# Altium project Phaser.PrjPCB (part 3 of 5)

## Sheet DAC.SchDoc: Phaser
size 420 x 297 mm; EDA_Number: ARTIQ; Projet: ARTIQ/SINARA; Author: G.Kasprowicz; CompanyName: WUT ISE; DrawnBy: G.Kasprowicz; Organization: WUT ISE; Address1: PW ISE; Address2: Nowowiejska 15/19 00-665 Warsaw; Address3: gkasprow@gmail.com; Revision: 2; SheetNumber: -; SheetTotal: -; ModifiedBy: -; CheckedDate: -; Title2: xxx; DivGrp: WUT ISE; Designer: G.Kasprowicz; ModifiedDate: -; ProjectName: Sensor Box
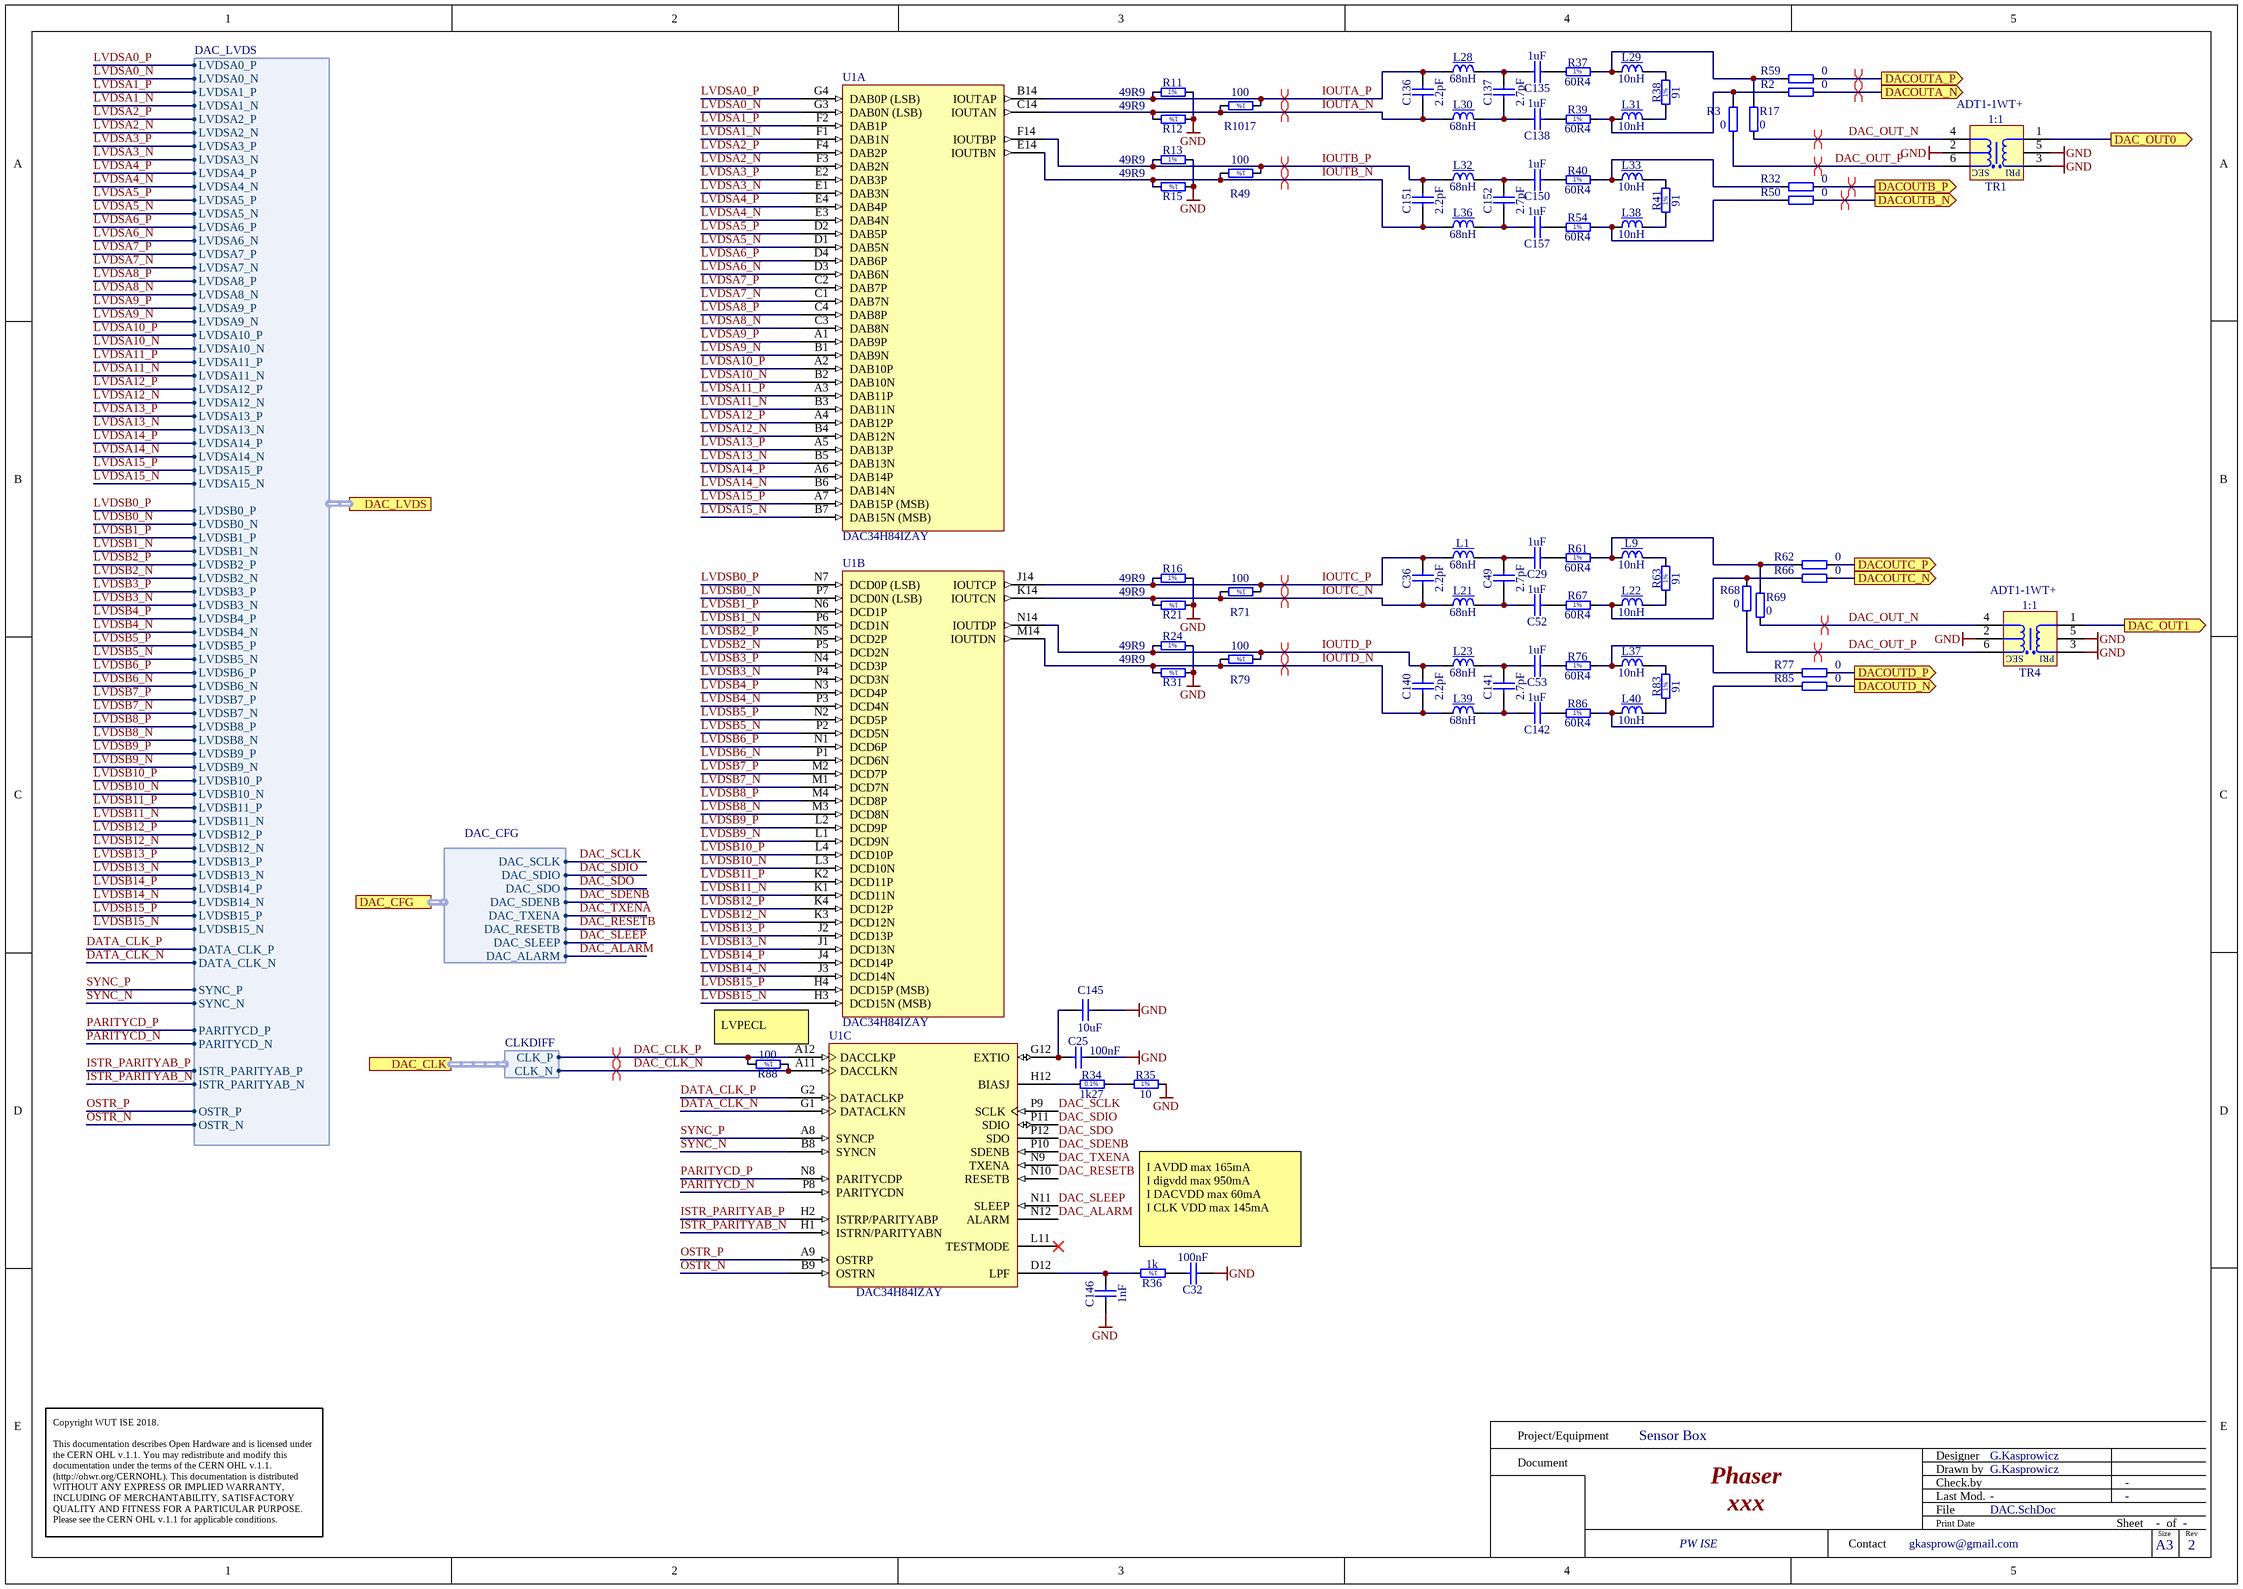
[diagram p6: DAC.SchDoc]

### Parts
C25  100nF  [CAPC1005X55N]
C29  1uF  [CAPC1005X55N]
C32  100nF  [CAPC1608X90N]
C36  2.2pF  [CAPC1608X87N]
C49  2.7pF  [CAPC1608X87N]
C52  1uF  [CAPC1005X55N]
C53  1uF  [CAPC1005X55N]
C135  1uF  [CAPC1005X55N]
C136  2.2pF  [CAPC1608X87N]
C137  2.7pF  [CAPC1608X87N]
C138  1uF  [CAPC1005X55N]
C140  2.2pF  [CAPC1608X87N]
C141  2.7pF  [CAPC1608X87N]
C142  1uF  [CAPC1005X55N]
C145  10uF  [CAPC2012X95N]
C146  1nF  [CAPC1608X90N]
C150  1uF  [CAPC1005X55N]
C151  2.2pF  [CAPC1608X87N]
C152  2.7pF  [CAPC1608X87N]
C157  1uF  [CAPC1005X55N]
L1  68nH  [IND_COILCRAFT_0603HP]
L9  10nH  [IND_COILCRAFT_0402DC]
L21  68nH  [IND_COILCRAFT_0603HP]
L22  10nH  [IND_COILCRAFT_0402DC]
L23  68nH  [IND_COILCRAFT_0603HP]
L28  68nH  [IND_COILCRAFT_0603HP]
L29  10nH  [IND_COILCRAFT_0402DC]
L30  68nH  [IND_COILCRAFT_0603HP]
L31  10nH  [IND_COILCRAFT_0402DC]
L32  68nH  [IND_COILCRAFT_0603HP]
L33  10nH  [IND_COILCRAFT_0402DC]
L36  68nH  [IND_COILCRAFT_0603HP]
L37  10nH  [IND_COILCRAFT_0402DC]
L38  10nH  [IND_COILCRAFT_0402DC]
L39  68nH  [IND_COILCRAFT_0603HP]
L40  10nH  [IND_COILCRAFT_0402DC]
R2  0  [RESC1005X40N]
R3  0  [RESC1005X40N]
R11  49R9  [RESC1005X40N]
R12  49R9  [RESC1005X40N]
R13  49R9  [RESC1005X40N]
R15  49R9  [RESC1005X40N]
R16  49R9  [RESC1005X40N]
R17  0  [RESC1005X40N]
R21  49R9  [RESC1005X40N]
R24  49R9  [RESC1005X40N]
R31  49R9  [RESC1005X40N]
R32  0  [RESC1005X40N]
R34  1k27  [RESC1608X55N]
R35  10  [RESC1005X40N]
R36  1k  [RESC1608X55N]
R37  60R4  [RESC1005X40N]
R38  91  [RESC1005X40N]
R39  60R4  [RESC1005X40N]
R40  60R4  [RESC1005X40N]
R41  91  [RESC1005X40N]
R49  100  [RESC0603X28N]
R50  0  [RESC1005X40N]
R54  60R4  [RESC1005X40N]
R59  0  [RESC1005X40N]
R61  60R4  [RESC1005X40N]
R62  0  [RESC1005X40N]
R63  91  [RESC1005X40N]
R66  0  [RESC1005X40N]
R67  60R4  [RESC1005X40N]
R68  0  [RESC1005X40N]
R69  0  [RESC1005X40N]
R71  100  [RESC0603X28N]
R76  60R4  [RESC1005X40N]
R77  0  [RESC1005X40N]
R79  100  [RESC0603X28N]
R83  91  [RESC1005X40N]
R85  0  [RESC1005X40N]
R86  60R4  [RESC1005X40N]
R88  100  [RESC0603X28N]
R1017  100  [RESC0603X28N]
TR1  1:1  Manufacturer Part Number: ADT1-1WT+  [XFMR_MINI-CIRCUITS_CD542]
TR4  1:1  Manufacturer Part Number: ADT1-1WT+  [XFMR_MINI-CIRCUITS_CD542]
U1  DAC34H84IZAY  [TI-ZAY196]  (parts A,B,C of 5)

### Ports
DAC_CFG (harness DAC_CFG), DAC_CLK (harness CLKDIFF), DAC_LVDS (harness DAC_LVDS), DAC_OUT0 (out), DAC_OUT1 (out), DACOUTA_N (out), DACOUTA_P (out), DACOUTB_N (out), DACOUTB_P (out), DACOUTC_N (out), DACOUTC_P (out), DACOUTD_N (out), DACOUTD_P (out)

### Harnesses
DAC_CFG: DAC_SCLK, DAC_SDIO, DAC_SDO, DAC_SDENB, DAC_TXENA, DAC_RESETB, DAC_SLEEP, DAC_ALARM
DAC_LVDS: LVDSA0_P, LVDSA0_N, LVDSA1_P, LVDSA1_N, LVDSA2_P, LVDSA2_N, LVDSA3_P, LVDSA3_N, LVDSA4_P, LVDSA4_N, LVDSA5_P, LVDSA5_N, LVDSA6_P, LVDSA6_N, LVDSA7_P, LVDSA7_N, LVDSA8_P, LVDSA8_N, LVDSA9_P, LVDSA9_N, LVDSA10_P, LVDSA10_N, LVDSA11_P, LVDSA11_N, LVDSA12_P, LVDSA12_N, LVDSA13_P, LVDSA13_N, LVDSA14_P, LVDSA14_N, LVDSA15_P, LVDSA15_N, LVDSB0_P, LVDSB0_N, LVDSB1_P, LVDSB1_N, LVDSB2_P, LVDSB2_N, LVDSB3_P, LVDSB3_N, LVDSB4_P, LVDSB4_N, LVDSB5_P, LVDSB5_N, LVDSB6_P, LVDSB6_N, LVDSB7_P, LVDSB7_N, LVDSB8_P, LVDSB8_N, LVDSB9_P, LVDSB9_N, LVDSB10_P, LVDSB10_N, LVDSB11_P, LVDSB11_N, LVDSB12_P, LVDSB12_N, LVDSB13_P, LVDSB13_N, LVDSB14_P, LVDSB14_N, LVDSB15_P, LVDSB15_N, DATA_CLK_P, DATA_CLK_N, SYNC_P, SYNC_N, PARITYCD_P, PARITYCD_N, ISTR_PARITYAB_P, ISTR_PARITYAB_N, OSTR_P, OSTR_N
CLKDIFF: CLK_N, CLK_P

### Nets
GND: C25.2 C32.1 C145.1 C146.1 R11.2 R12.1 R13.2 R15.1 R16.2 R21.1 R24.2 R31.1 R35.2 TR1.2(SCT) TR1.3(PDOT) TR1.5(NC) TR4.2(SCT) TR4.3(PDOT) TR4.5(NC)
DAC_ALARM: U1.N12(ALARM) ; port DAC_CFG.DAC_ALARM
DAC_CLK_N: R88.1 U1.A11(DACCLKN) ; port DAC_CLK.CLK_N
DAC_CLK_P: R88.2 U1.A12(DACCLKP) ; port DAC_CLK.CLK_P
DAC_OUT_N: R17.1 R69.1 TR1.4(S) TR4.4(S)
DAC_OUT_P: R3.1 R68.1 TR1.6(SDOT) TR4.6(SDOT)
DAC_RESETB: U1.N10(RESETB) ; port DAC_CFG.DAC_RESETB
DAC_SCLK: U1.P9(SCLK) ; port DAC_CFG.DAC_SCLK
DAC_SDENB: U1.P10(SDENB) ; port DAC_CFG.DAC_SDENB
DAC_SDIO: U1.P11(SDIO) ; port DAC_CFG.DAC_SDIO
DAC_SDO: U1.P12(SDO) ; port DAC_CFG.DAC_SDO
DAC_SLEEP: U1.N11(SLEEP) ; port DAC_CFG.DAC_SLEEP
DAC_TXENA: U1.N9(TXENA) ; port DAC_CFG.DAC_TXENA
DATA_CLK_N: U1.G1(DATACLKN) ; port DAC_LVDS.DATA_CLK_N
DATA_CLK_P: U1.G2(DATACLKP) ; port DAC_LVDS.DATA_CLK_P
IOUTA_N: C136.1 L30.1 R12.2 R1017.2 U1.C14(IOUTAN)
IOUTA_P: C136.2 L28.1 R11.1 R1017.1 U1.B14(IOUTAP)
IOUTB_N: C151.1 L36.1 R15.2 R49.2 U1.E14(IOUTBN)
IOUTB_P: C151.2 L32.1 R13.1 R49.1 U1.F14(IOUTBP)
IOUTC_N: C36.1 L21.1 R21.2 R71.2 U1.K14(IOUTCN)
IOUTC_P: C36.2 L1.1 R16.1 R71.1 U1.J14(IOUTCP)
IOUTD_N: C140.1 L39.1 R31.2 R79.2 U1.M14(IOUTDN)
IOUTD_P: C140.2 L23.1 R24.1 R79.1 U1.N14(IOUTDP)
ISTR_PARITYAB_N: U1.H1(ISTRN/PARITYABN) ; port DAC_LVDS.ISTR_PARITYAB_N
ISTR_PARITYAB_P: U1.H2(ISTRP/PARITYABP) ; port DAC_LVDS.ISTR_PARITYAB_P
LVDSA0_N: U1.G3(DAB0N_(LSB)) ; port DAC_LVDS.LVDSA0_N
LVDSA0_P: U1.G4(DAB0P_(LSB)) ; port DAC_LVDS.LVDSA0_P
LVDSA1_N: U1.F1(DAB1N) ; port DAC_LVDS.LVDSA1_N
LVDSA1_P: U1.F2(DAB1P) ; port DAC_LVDS.LVDSA1_P
LVDSA2_N: U1.F3(DAB2N) ; port DAC_LVDS.LVDSA2_N
LVDSA2_P: U1.F4(DAB2P) ; port DAC_LVDS.LVDSA2_P
LVDSA3_N: U1.E1(DAB3N) ; port DAC_LVDS.LVDSA3_N
LVDSA3_P: U1.E2(DAB3P) ; port DAC_LVDS.LVDSA3_P
LVDSA4_N: U1.E3(DAB4N) ; port DAC_LVDS.LVDSA4_N
LVDSA4_P: U1.E4(DAB4P) ; port DAC_LVDS.LVDSA4_P
LVDSA5_N: U1.D1(DAB5N) ; port DAC_LVDS.LVDSA5_N
LVDSA5_P: U1.D2(DAB5P) ; port DAC_LVDS.LVDSA5_P
LVDSA6_N: U1.D3(DAB6N) ; port DAC_LVDS.LVDSA6_N
LVDSA6_P: U1.D4(DAB6P) ; port DAC_LVDS.LVDSA6_P
LVDSA7_N: U1.C1(DAB7N) ; port DAC_LVDS.LVDSA7_N
LVDSA7_P: U1.C2(DAB7P) ; port DAC_LVDS.LVDSA7_P
LVDSA8_N: U1.C3(DAB8N) ; port DAC_LVDS.LVDSA8_N
LVDSA8_P: U1.C4(DAB8P) ; port DAC_LVDS.LVDSA8_P
LVDSA9_N: U1.B1(DAB9N) ; port DAC_LVDS.LVDSA9_N
LVDSA9_P: U1.A1(DAB9P) ; port DAC_LVDS.LVDSA9_P
LVDSA10_N: U1.B2(DAB10N) ; port DAC_LVDS.LVDSA10_N
LVDSA10_P: U1.A2(DAB10P) ; port DAC_LVDS.LVDSA10_P
LVDSA11_N: U1.B3(DAB11N) ; port DAC_LVDS.LVDSA11_N
LVDSA11_P: U1.A3(DAB11P) ; port DAC_LVDS.LVDSA11_P
LVDSA12_N: U1.B4(DAB12N) ; port DAC_LVDS.LVDSA12_N
LVDSA12_P: U1.A4(DAB12P) ; port DAC_LVDS.LVDSA12_P
LVDSA13_N: U1.B5(DAB13N) ; port DAC_LVDS.LVDSA13_N
LVDSA13_P: U1.A5(DAB13P) ; port DAC_LVDS.LVDSA13_P
LVDSA14_N: U1.B6(DAB14N) ; port DAC_LVDS.LVDSA14_N
LVDSA14_P: U1.A6(DAB14P) ; port DAC_LVDS.LVDSA14_P
LVDSA15_N: U1.B7(DAB15N_(MSB)) ; port DAC_LVDS.LVDSA15_N
LVDSA15_P: U1.A7(DAB15P_(MSB)) ; port DAC_LVDS.LVDSA15_P
LVDSB0_N: U1.P7(DCD0N_(LSB)) ; port DAC_LVDS.LVDSB0_N
LVDSB0_P: U1.N7(DCD0P_(LSB)) ; port DAC_LVDS.LVDSB0_P
LVDSB1_N: U1.P6(DCD1N) ; port DAC_LVDS.LVDSB1_N
LVDSB1_P: U1.N6(DCD1P) ; port DAC_LVDS.LVDSB1_P
LVDSB2_N: U1.P5(DCD2N) ; port DAC_LVDS.LVDSB2_N
LVDSB2_P: U1.N5(DCD2P) ; port DAC_LVDS.LVDSB2_P
LVDSB3_N: U1.P4(DCD3N) ; port DAC_LVDS.LVDSB3_N
LVDSB3_P: U1.N4(DCD3P) ; port DAC_LVDS.LVDSB3_P
LVDSB4_N: U1.P3(DCD4N) ; port DAC_LVDS.LVDSB4_N
LVDSB4_P: U1.N3(DCD4P) ; port DAC_LVDS.LVDSB4_P
LVDSB5_N: U1.P2(DCD5N) ; port DAC_LVDS.LVDSB5_N
LVDSB5_P: U1.N2(DCD5P) ; port DAC_LVDS.LVDSB5_P
LVDSB6_N: U1.P1(DCD6N) ; port DAC_LVDS.LVDSB6_N
LVDSB6_P: U1.N1(DCD6P) ; port DAC_LVDS.LVDSB6_P
LVDSB7_N: U1.M1(DCD7N) ; port DAC_LVDS.LVDSB7_N
LVDSB7_P: U1.M2(DCD7P) ; port DAC_LVDS.LVDSB7_P
LVDSB8_N: U1.M3(DCD8N) ; port DAC_LVDS.LVDSB8_N
LVDSB8_P: U1.M4(DCD8P) ; port DAC_LVDS.LVDSB8_P
LVDSB9_N: U1.L1(DCD9N) ; port DAC_LVDS.LVDSB9_N
LVDSB9_P: U1.L2(DCD9P) ; port DAC_LVDS.LVDSB9_P
LVDSB10_N: U1.L3(DCD10N) ; port DAC_LVDS.LVDSB10_N
LVDSB10_P: U1.L4(DCD10P) ; port DAC_LVDS.LVDSB10_P
LVDSB11_N: U1.K1(DCD11N) ; port DAC_LVDS.LVDSB11_N
LVDSB11_P: U1.K2(DCD11P) ; port DAC_LVDS.LVDSB11_P
LVDSB12_N: U1.K3(DCD12N) ; port DAC_LVDS.LVDSB12_N
LVDSB12_P: U1.K4(DCD12P) ; port DAC_LVDS.LVDSB12_P
LVDSB13_N: U1.J1(DCD13N) ; port DAC_LVDS.LVDSB13_N
LVDSB13_P: U1.J2(DCD13P) ; port DAC_LVDS.LVDSB13_P
LVDSB14_N: U1.J3(DCD14N) ; port DAC_LVDS.LVDSB14_N
LVDSB14_P: U1.J4(DCD14P) ; port DAC_LVDS.LVDSB14_P
LVDSB15_N: U1.H3(DCD15N_(MSB)) ; port DAC_LVDS.LVDSB15_N
LVDSB15_P: U1.H4(DCD15P_(MSB)) ; port DAC_LVDS.LVDSB15_P
OSTR_N: U1.B9(OSTRN) ; port DAC_LVDS.OSTR_N
OSTR_P: U1.A9(OSTRP) ; port DAC_LVDS.OSTR_P
PARITYCD_N: U1.P8(PARITYCDN) ; port DAC_LVDS.PARITYCD_N
PARITYCD_P: U1.N8(PARITYCDP) ; port DAC_LVDS.PARITYCD_P
SYNC_N: U1.B8(SYNCN) ; port DAC_LVDS.SYNC_N
SYNC_P: U1.A8(SYNCP) ; port DAC_LVDS.SYNC_P
NetC25_1: C25.1 C145.2 U1.G12(EXTIO)
NetC29_1: C29.1 R61.1
NetC29_2: C29.2 C49.2 L1.2
NetC32_2: C32.2 R36.1
NetC49_1: C49.1 C52.2 L21.2
NetC52_1: C52.1 R67.1
NetC53_1: C53.1 R76.1
NetC53_2: C53.2 C141.2 L23.2
NetC135_1: C135.1 R37.1
NetC135_2: C135.2 C137.2 L28.2
NetC137_1: C137.1 C138.2 L30.2
NetC138_1: C138.1 R39.1
NetC141_1: C141.1 C142.2 L39.2
NetC142_1: C142.1 R86.1
NetC146_2: C146.2 R36.2 U1.D12(LPF)
NetC150_1: C150.1 R40.1
NetC150_2: C150.2 C152.2 L32.2
NetC152_1: C152.1 C157.2 L36.2
NetC157_1: C157.1 R54.1
NetL9_1: L9.1 R61.2 R62.2 R69.2
NetL9_2: L9.2 R63.2
NetL22_1: L22.1 R66.2 R67.2 R68.2
NetL22_2: L22.2 R63.1
NetL29_1: L29.1 R17.2 R37.2 R59.2
NetL29_2: L29.2 R38.2
NetL31_1: L31.1 R2.2 R3.2 R39.2
NetL31_2: L31.2 R38.1
NetL33_1: L33.1 R32.2 R40.2
NetL33_2: L33.2 R41.2
NetL37_1: L37.1 R76.2 R77.2
NetL37_2: L37.2 R83.2
NetL38_1: L38.1 R50.2 R54.2
NetL38_2: L38.2 R41.1
NetL40_1: L40.1 R85.2 R86.2
NetL40_2: L40.2 R83.1
NetR2_1: R2.1 ; port DACOUTA_N
NetR32_1: R32.1 ; port DACOUTB_P
NetR34_1: R34.1 U1.H12(BIASJ)
NetR34_2: R34.2 R35.1
NetR50_1: R50.1 ; port DACOUTB_N
NetR59_1: R59.1 ; port DACOUTA_P
NetR62_1: R62.1 ; port DACOUTC_P
NetR66_1: R66.1 ; port DACOUTC_N
NetR77_1: R77.1 ; port DACOUTD_P
NetR85_1: R85.1 ; port DACOUTD_N
NetR184A_1: TR1.1(P) ; port DAC_OUT0
NetR184B_1: TR4.1(P) ; port DAC_OUT1

Not connected (* = marked no-connect by the designer): U1 L11(TESTMODE)*

### Layout directives
differential pair; differential pair class I_analog: IOUTA_N, IOUTA_P, IOUTB_N, IOUTB_P, IOUTC_N, IOUTC_P, IOUTD_N, IOUTD_P
differential pair; differential pair class Diff_100Ohm: DAC_CLK_N, DAC_CLK_P
differential pair: DAC_OUT_N, DAC_OUT_P, NetR2_1, NetR32_1, NetR50_1, NetR59_1

### Notes on the sheet
- LVPECL
- I AVDD max 165mA
  I digvdd max 950mA
  I DACVDD max 60mA
  I CLK VDD max 145mA
- Project/Equipment
- Document
- Designer
- Drawn by
- Check.by
- Copyright WUT ISE 2018.
  This documentation describes Open Hardware and is licensed under the CERN OHL v.1.1. You may redistribute and modify this documentation under the terms of the CERN OHL v.1.1. (http://ohwr.org/CERNOHL). This documentation is distributed WITHOUT ANY EXPRESS OR IMPLIED WARRANTY, INCLUDING OF MERCHANTABILITY, SATISFACTORY QUALITY AND FITNESS FOR A PARTICULAR PURPOSE. Please see the CERN OHL v.1.1 for applicable conditions.
- Contact
- File
- Last Mod.
- Print Date
- Sheet
- Size
- A3
- of
- Rev
- (in symbol R0201_100R_1%_0.05W_200PPM) 1%
- (in symbol R0402_10R_1%_0.0625W_200PPM) 1%
- (in symbol R0402_49R9_1%_0.0625W_100PPM) 1%
- (in symbol R0402_60R4_1%_0.0625W_100PPM) 1%
- (in symbol R0402_91R_1%_0.0625W_100PPM) 1%
- (in symbol R0603_1K27_0.1%_0.063W_10PPM) 0.1%
- (in symbol R0603_1K_1%_0.1W_100PPM) 1%
- (in symbol XFMR_MINI-CIRCUITS_ADT1-1WT+) SEC; PRI

### Library data of the parts
C25 = CC0402_100NF_16V_10%_X5R: Non-polarised capacitor; Part Description: SMD Multilayer Chip Ceramic Capacitor; Manufacturer: GENERIC; Manufacturer1 Part Number: GRM155R61C104KA88D; Voltage: 16V; TC: X5R; Tolerance: ±10%; Part Number: CC0402_100NF_16V_10%_X5R; Component Kind: Standard; Component Type: Standard; Pin Count: 2; Value: 100nF; Status: None; Manufacturer Part Number: CC0402_100NF_16V_10%_X5R; Case: 0402; Mounted: Yes; Socket: No; SMD: Yes; Sense: No; Manufacturer1 Example: MURATA; Manufacturer1 ComponentHeight: 0.55mm; HelpURL: \\cern.ch\dfs\Applications\Altium\Datasheets\CC0402_X5R_MURATA_GRM.pdf; Author: CERN DEM JLC; CreateDate: 10.12.2013; LatestRevisionDate: 10.12.2013
C29 C52 C53 C135 C138 C142 C150 C157 = CC0402_1UF_16V_10%_X5R: Non-polarised capacitor; Part Description: SMD Multilayer Chip Ceramic Capacitor; Manufacturer: GENERIC; Manufacturer1 Part Number: C1005X5R1C105KT; Voltage: 16V; TC: X5R; Tolerance: ±10%; Part Number: CC0402_1UF_16V_10%_X5R; Component Kind: Standard; Component Type: Standard; Pin Count: 2; Value: 1uF; Status: Preferred; Manufacturer Part Number: CC0402_1UF_16V_10%_X5R; Case: 0402; Mounted: Yes; Socket: No; SMD: Yes; Sense: No; Manufacturer1 Example: TDK; Manufacturer1 ComponentHeight: 0.55mm; HelpURL: \\cern.ch\dfs\Applications\Altium\Datasheets\CC0402_X5R_TDK_C.pdf; Author: CERN DEM JLC; CreateDate: 25.10.2012; LatestRevisionDate: 25.10.2012
C32 = CC0603_100NF_100V_10%_X7R: Non-polarised capacitor; Part Description: SMD Multilayer Chip Ceramic Capacitor; Manufacturer: GENERIC; Manufacturer1 Part Number: GRM188R72A104KA35D; Voltage: 100V; TC: X7R; Tolerance: ±10%; Part Number: CC0603_100NF_100V_10%_X7R; Component Kind: Standard; Component Type: Standard; Pin Count: 2; Value: 100nF; Status: None; Manufacturer Part Number: CC0603_100NF_100V_10%_X7R; Case: 0603; Mounted: Yes; Socket: No; SMD: Yes; Sense: No; Manufacturer1 Example: MURATA; Manufacturer1 ComponentHeight: 0.9mm; HelpURL: \\cern.ch\dfs\Applications\Altium\Datasheets\CC0603_MURATA_GRM188R72A104KA35D.pdf; Author: CERN DEM JLC; CreateDate: 11.12.2013; LatestRevisionDate: 11.12.2013
C36 C136 C140 C151 = CC0603_2.2PF_50V_0.25PF_NP0: Non-polarised capacitor; Part Description: SMD Multilayer Chip Ceramic Capacitor; Manufacturer: GENERIC; Manufacturer1 Part Number: 223886715228; Voltage: 50V; TC: C0G/NP0; Tolerance: ±0.25pF; Part Number: CC0603_2.2PF_50V_0.25PF_NP0; Component Kind: Standard; Component Type: Standard; Pin Count: 2; Value: 2.2pF; Status: Preferred; Manufacturer Part Number: CC0603_2.2PF_50V_0.25PF_NP0; Case: 0603; Mounted: Yes; Socket: No; SMD: Yes; Sense: No; Manufacturer1 Example: PHYCOMP; Manufacturer1 ComponentHeight: 0.87mm; HelpURL: \\cern.ch\dfs\Applications\Altium\Datasheets\CC0603_NP0_PHYCOMP.pdf; Author: CERN DEM JLC; CreateDate: 03.12.2007; LatestRevisionDate: 03.12.2007
C49 C137 C141 C152 = CC0603_2.7PF_50V_0.25PF_NP0: Non-polarised capacitor; Part Description: SMD Multilayer Chip Ceramic Capacitor; Manufacturer: GENERIC; Manufacturer1 Part Number: 223886715278; Voltage: 50V; TC: C0G/NP0; Tolerance: ±0.25pF; Part Number: CC0603_2.7PF_50V_0.25PF_NP0; Component Kind: Standard; Component Type: Standard; Pin Count: 2; Value: 2.7pF; Status: Preferred; Manufacturer Part Number: CC0603_2.7PF_50V_0.25PF_NP0; Case: 0603; Mounted: Yes; Socket: No; SMD: Yes; Sense: No; Manufacturer1 Example: PHYCOMP; Manufacturer1 ComponentHeight: 0.87mm; HelpURL: \\cern.ch\dfs\Applications\Altium\Datasheets\CC0603_NP0_PHYCOMP.pdf; Author: CERN DEM JLC; CreateDate: 03.12.2007; LatestRevisionDate: 03.12.2007
C145 = CC0805_10UF_25V_10%_X5R: Non-polarised capacitor; Part Description: SMD Multilayer Chip Ceramic Capacitor; Manufacturer: GENERIC; Manufacturer1 Part Number: GRM219R61E106KA12D; Voltage: 25V; TC: X5R; Tolerance: ±10%; Part Number: CC0805_10UF_25V_10%_X5R; Component Kind: Standard; Component Type: Standard; Pin Count: 2; Value: 10uF; Status: Preferred; Manufacturer Part Number: CC0805_10UF_25V_10%_X5R; Case: 0805; Mounted: Yes; Socket: No; SMD: Yes; Sense: No; Manufacturer1 Example: MURATA; Manufacturer1 ComponentHeight: 0.95mm; HelpURL: \\cern.ch\dfs\Applications\Altium\Datasheets\CC0805_X5R_MURATA_GRM.pdf; Author: CERN DEM JLC; CreateDate: 25.10.2012; LatestRevisionDate: 06.09.2016
C146 = CC0603_1NF_50V_1%_NP0: Non-polarised capacitor; Part Description: SMD Multilayer Chip Ceramic Capacitor; Manufacturer: GENERIC; Manufacturer1 Part Number: 06035A102FAT2A; Voltage: 50V; TC: C0G/NP0; Tolerance: ±1%; Part Number: CC0603_1NF_50V_1%_NP0; Component Kind: Standard; Component Type: Standard; Pin Count: 2; Value: 1nF; Status: None; Manufacturer Part Number: CC0603_1NF_50V_1%_NP0; Case: 0603; Mounted: Yes; Socket: No; SMD: Yes; Sense: No; Manufacturer1 Example: AVX; Manufacturer1 ComponentHeight: 0.9mm; HelpURL: \\cern.ch\dfs\Applications\Altium\Datasheets\CC0603_C0G_AVX.pdf; Author: CERN DEM JLC; CreateDate: 15.06.2017; LatestRevisionDate: 15.06.2017
L1 L21 L23 L28 L30 L32 L36 L39 = IND0603_68NH_2%_COILCRAFT_0603HP-68NXGLU: Inductor With Core; Part Description: Ceramic Chip Inductor; Power: 600mA; Resistance: 0.33R; Tolerance: ±2%; Part Number: IND0603_68NH_2%_COILCRAFT_0603HP-68NXGLU; Component Kind: Standard; Component Type: Standard; Pin Count: 2; Value: 68nH; Status: None; Manufacturer: COILCRAFT; Manufacturer Part Number: 0603HP-68NXGLU; Case: 0603; Mounted: Yes; Socket: No; SMD: Yes; Sense: No; ComponentHeight: 0.94mm; HelpURL: \\cern.ch\dfs\Applications\Altium\Datasheets\IND0603_COILCRAFT_0603HP.pdf; Author: CERN DEM JLC; CreateDate: 16.11.2017; LatestRevisionDate: 16.11.2017
L9 L22 L29 L31 L33 L37 L38 L40 = IND0402_10NH_2%_COILCRAFT_0402DC: Inductor With Core; Part Description: Ceramic Wirewound Chip Inductor, 0402DC Series; Manufacturer Part Number: 0402DC-10NXGRW; Power: 1A; Resistance: 0.073R; Tolerance: ±2%; Part Number: IND0402_10NH_2%_COILCRAFT_0402DC; Component Kind: Standard; Component Type: Standard; Pin Count: 2; Value: 10nH; Status: None; Manufacturer: COILCRAFT; Case: 0402; Mounted: Yes; Socket: No; SMD: Yes; Sense: No; ComponentHeight: 0.61mm; HelpURL: \\cern.ch\dfs\Applications\Altium\Datasheets\IND0402_COILCRAFT_0402DC.pdf; Author: GK; CreateDate: 04.12.2018; LatestRevisionDate: 04.12.2018
R2 R3 R17 R32 R50 R59 R62 R66 R68 R69 R77 R85 = R0402_0R_JUMPER: Resistor; Part Description: 1A (0.05R Max DC Resistance) Zero Ohm Jumper; Manufacturer: GENERIC; Manufacturer1 Part Number: 232270591001L; Part Number: R0402_0R_JUMPER; Component Kind: Standard; Component Type: Standard; Pin Count: 2; Value: 0; Status: Not recommended; Manufacturer Part Number: R0402_0R_JUMPER; Case: 0402; Mounted: Yes; Sense: No; Socket: No; SMD: Yes; Manufacturer1 Example: YAGEO PHYCOMP; Manufacturer1 ComponentHeight: 0.4mm; HelpURL: \\cern.ch\dfs\Applications\Altium\Datasheets\R0402_Phycomp_RC0402.pdf; Author: CERN DEM JLC; CreateDate: 2007-12-03; LatestRevisionDate: 2012-10-17
R11-R13 R15 R16 R21 R24 R31 = R0402_49R9_1%_0.0625W_100PPM: Resistor - 1%; Part Description: General Purpose Thick Film Chip Resistor; Manufacturer: GENERIC; Manufacturer1 Part Number: 232270674999L or RC0402FR-0749R9L; TC: ±100ppm/°C; PressFit: No; Part Number: R0402_49R9_1%_0.0625W_100PPM; Component Kind: Standard; Component Type: Standard; Pin Count: 2; Value: 49R9; Status: Not Recommended; Power: 0.0625W; Tolerance: ±1%; Manufacturer Part Number: R0402_49R9_1%_0.0625W_100PPM; Case: 0402; Mounted: Yes; Sense: No; Socket: No; SMD: Yes; Manufacturer1 Example: YAGEO PHYCOMP; Manufacturer1 ComponentHeight: 0.4mm; HelpURL: \\cern.ch\dfs\Applications\Altium\Datasheets\R0402_Phycomp_RC0402.pdf; Author: CERN DEM JLC; CreateDate: 24.10.2012; LatestRevisionDate: 24.10.2012
R34 = R0603_1K27_0.1%_0.063W_10PPM: Resistor - 0.1%; Part Description: Thin Film Chip Resistor; Manufacturer: GENERIC; Manufacturer1 Part Number: RN73C1J1K27BTDF; Power: 0.063W; TC: ±10ppm; PressFit: No; Part Number: R0603_1K27_0.1%_0.063W_10PPM; Component Kind: Standard; Component Type: Standard; Pin Count: 2; Value: 1k27; Status: Not Recommended; Tolerance: ±0.1%; Manufacturer Part Number: R0603_1K27_0.1%_0.063W_10PPM; Case: 0603; Mounted: Yes; Sense: No; Socket: No; SMD: Yes; Manufacturer1 Example: TYCO HOLSWORTHY; Manufacturer1 ComponentHeight: 0.5mm; HelpURL: \\cern.ch\dfs\Applications\Altium\Datasheets\R0603_Tyco_RN73.pdf; Author: CERN DEM JLC; CreateDate: 03.12.2007; LatestRevisionDate: 13.03.2008
R35 = R0402_10R_1%_0.0625W_200PPM: Resistor - 1%; Part Description: General Purpose Thick Film Chip Resistor; Manufacturer: GENERIC; Manufacturer1 Part Number: 232270671009L; TC: ±200ppm/°C; PressFit: No; Part Number: R0402_10R_1%_0.0625W_200PPM; Component Kind: Standard; Component Type: Standard; Pin Count: 2; Value: 10; Status: Not Recommended; Power: 0.0625W; Tolerance: ±1%; Manufacturer Part Number: R0402_10R_1%_0.0625W_200PPM; Case: 0402; Mounted: Yes; Sense: No; Socket: No; SMD: Yes; Manufacturer1 Example: YAGEO PHYCOMP; Manufacturer1 ComponentHeight: 0.4mm; HelpURL: \\cern.ch\dfs\Applications\Altium\Datasheets\R0402_Phycomp_RC0402.pdf; Author: CERN DEM JLC; CreateDate: 24.06.2009; LatestRevisionDate: 17.10.2012
R36 = R0603_1K_1%_0.1W_100PPM: Resistor - 1%; Part Description: General Purpose Thick Film Chip Resistor; Manufacturer: GENERIC; Manufacturer1 Part Number: NRC06F1001TRF; Power: 0.1W; TC: ±100ppm/°C; PressFit: No; Part Number: R0603_1K_1%_0.1W_100PPM; Component Kind: Standard; Component Type: Standard; Pin Count: 2; Value: 1k; Status: Preferred; Tolerance: ±1%; Manufacturer Part Number: R0603_1K_1%_0.1W_100PPM; Case: 0603; Mounted: Yes; Sense: No; Socket: No; SMD: Yes; Manufacturer1 Example: NIC COMPONENT; Manufacturer1 ComponentHeight: 0.55mm; HelpURL: \\cern.ch\dfs\Applications\Altium\Datasheets\R0603_NIC_NRC.pdf; Author: CERN DEM JLC; CreateDate: 03.12.2007; LatestRevisionDate: 13.03.2008
R37 R39 R40 R54 R61 R67 R76 R86 = R0402_60R4_1%_0.0625W_100PPM: Resistor - 1%; Part Description: General Purpose Thick Film Chip Resistor; Manufacturer: GENERIC; Manufacturer1 Part Number: RC0402FR-0760R4L; TC: ±100ppm/°C; PressFit: No; Part Number: R0402_60R4_1%_0.0625W_100PPM; Component Kind: Standard; Component Type: Standard; Pin Count: 2; Value: 60R4; Status: Recommended; Power: 0.0625W; Tolerance: ±1%; Manufacturer Part Number: R0402_60R4_1%_0.0625W_100PPM; Case: 0402; Mounted: Yes; Sense: No; Socket: No; SMD: Yes; Manufacturer1 Example: YAGEO; Manufacturer1 ComponentHeight: 0.4mm; HelpURL: \\cern.ch\dfs\Applications\Altium\Datasheets\R0402_Phycomp_RC0402.pdf; Author: GK; CreateDate: 03.12.2007; LatestRevisionDate: 17.10.2012
R38 R41 R63 R83 = R0402_91R_1%_0.0625W_100PPM: Resistor - 1%; Part Description: General Purpose Thick Film Chip Resistor; Manufacturer: GENERIC; Manufacturer1 Part Number: 232270679109L; TC: ±100ppm/°C; PressFit: No; Part Number: R0402_91R_1%_0.0625W_100PPM; Component Kind: Standard; Component Type: Standard; Pin Count: 2; Value: 91; Status: Not Recommended; Power: 0.0625W; Tolerance: ±1%; Manufacturer Part Number: R0402_91R_1%_0.0625W_100PPM; Case: 0402; Mounted: Yes; Sense: No; Socket: No; SMD: Yes; Manufacturer1 Example: YAGEO PHYCOMP; Manufacturer1 ComponentHeight: 0.4mm; HelpURL: \\cern.ch\dfs\Applications\Altium\Datasheets\R0402_Phycomp_RC0402.pdf; Author: CERN DEM JLC; CreateDate: 03.12.2007; LatestRevisionDate: 17.10.2012
R49 R71 R79 R88 R1017 = R0201_100R_1%_0.05W_200PPM: Resistor - 1%; Part Description: Thick Film Chip Resistor; Manufacturer: GENERIC; Manufacturer1 Part Number: CRCW0201100RFNED; Power: 0.05W; TC: ±200ppm/°C; PressFit: No; Part Number: R0201_100R_1%_0.05W_200PPM; Component Kind: Standard; Component Type: Standard; Pin Count: 2; Value: 100; Status: Not Recommended; Tolerance: ±1%; Manufacturer Part Number: R0201_100R_1%_0.05W_200PPM; Case: 0201; Mounted: Yes; Sense: No; Socket: No; SMD: Yes; Manufacturer1 Example: VISHAY; Manufacturer1 ComponentHeight: 0.27mm; HelpURL: \\cern.ch\dfs\Applications\Altium\Datasheets\R0201_VISHAY_CRCW0201 e3.pdf; Author: CERN DEM JLC; CreateDate: 13.11.2014; LatestRevisionDate: 13.11.2014
TR1 TR4 = XFMR_MINI-CIRCUITS_ADT1-1WT+: 75 Ohm 0.4 To 800MHz RF Transformers; Part Description: 75 Ohms 0.4 to 800 MHz RF Transformer; Part Number: XFMR_MINI-CIRCUITS_ADT1-1WT+; Component Kind: Standard; Component Type: Standard; Pin Count: 6; Value: 1:1; Status: None; Manufacturer: MINI-CIRCUITS; Mounted: Yes; Socket: No; Sense: No; SMD: Yes; ComponentHeight: 2.84mm; HelpURL: \\cern.ch\dfs\Applications\Altium\Datasheets\XFMR_MINI-CIRCUITS_ADT1-1WT+.pdf; Author: CERN DEM JLC; CreateDate: 21.09.2011; LatestRevisionDate: 21.09.2011
U1 = CMP-0004-01532-1: Quad-Channel, 16-Bit, 1.5 GSPS DAC, -40 to 85 degC, 196-pin BGA (ZAY196), Green (RoHS & no Sb/Br); Manufacturer: Texas Instruments; Interface: Parallel LVDS; Resolution(Bits): 16; SubFamily: High Speed DAC (>10MSPS); Power Consumption(Typ)(mW): 1828; SFDR(dB): 78; DAC Channels: 4; Mounting Technology: Surface Mount; ComponentLink3URL: http://www.ti.com/litv/pdf/mpbga11; PartNumber: DAC34H84IZAY; ComponentLink1Description: Manufacturer URL; Eco-Plan: Green (RoHS & no Sb/Br); PackageDescription: 196-Pin Plastic Ball Grid Array, Body 12 x 12 mm, Pitch 0.8 mm; PackageVersion: 4208324-4/C, 09/2010; PackageReference: ZAY196; ComponentLink1URL: http://www.ti.com/; ComponentLink2URL: http://www.ti.com/general/docs/lit/getliterature.tsp?genericPartNumber=DAC34SH84&fileType=pdf; DatasheetVersion: SLAS808D; ComponentLink3Description: Package Specification; ComponentLink2Description: Datasheet

## Sheet FPGA_SUP_CFG.SchDoc: Phaser
size 420 x 297 mm; EDA_Number: ARTIQ; Projet: ARTIQ/SINARA; Author: G.Kasprowicz; CompanyName: WUT ISE; DrawnBy: G.Kasprowicz; Organization: WUT ISE; Address1: PW ISE; Address2: Nowowiejska 15/19 00-665 Warsaw; Address3: gkasprow@gmail.com; Revision: 2; SheetNumber: -; SheetTotal: -; ModifiedBy: -; CheckedDate: -; Title2: xxx; DivGrp: WUT ISE; Designer: G.Kasprowicz; ModifiedDate: -; ProjectName: Sensor Box
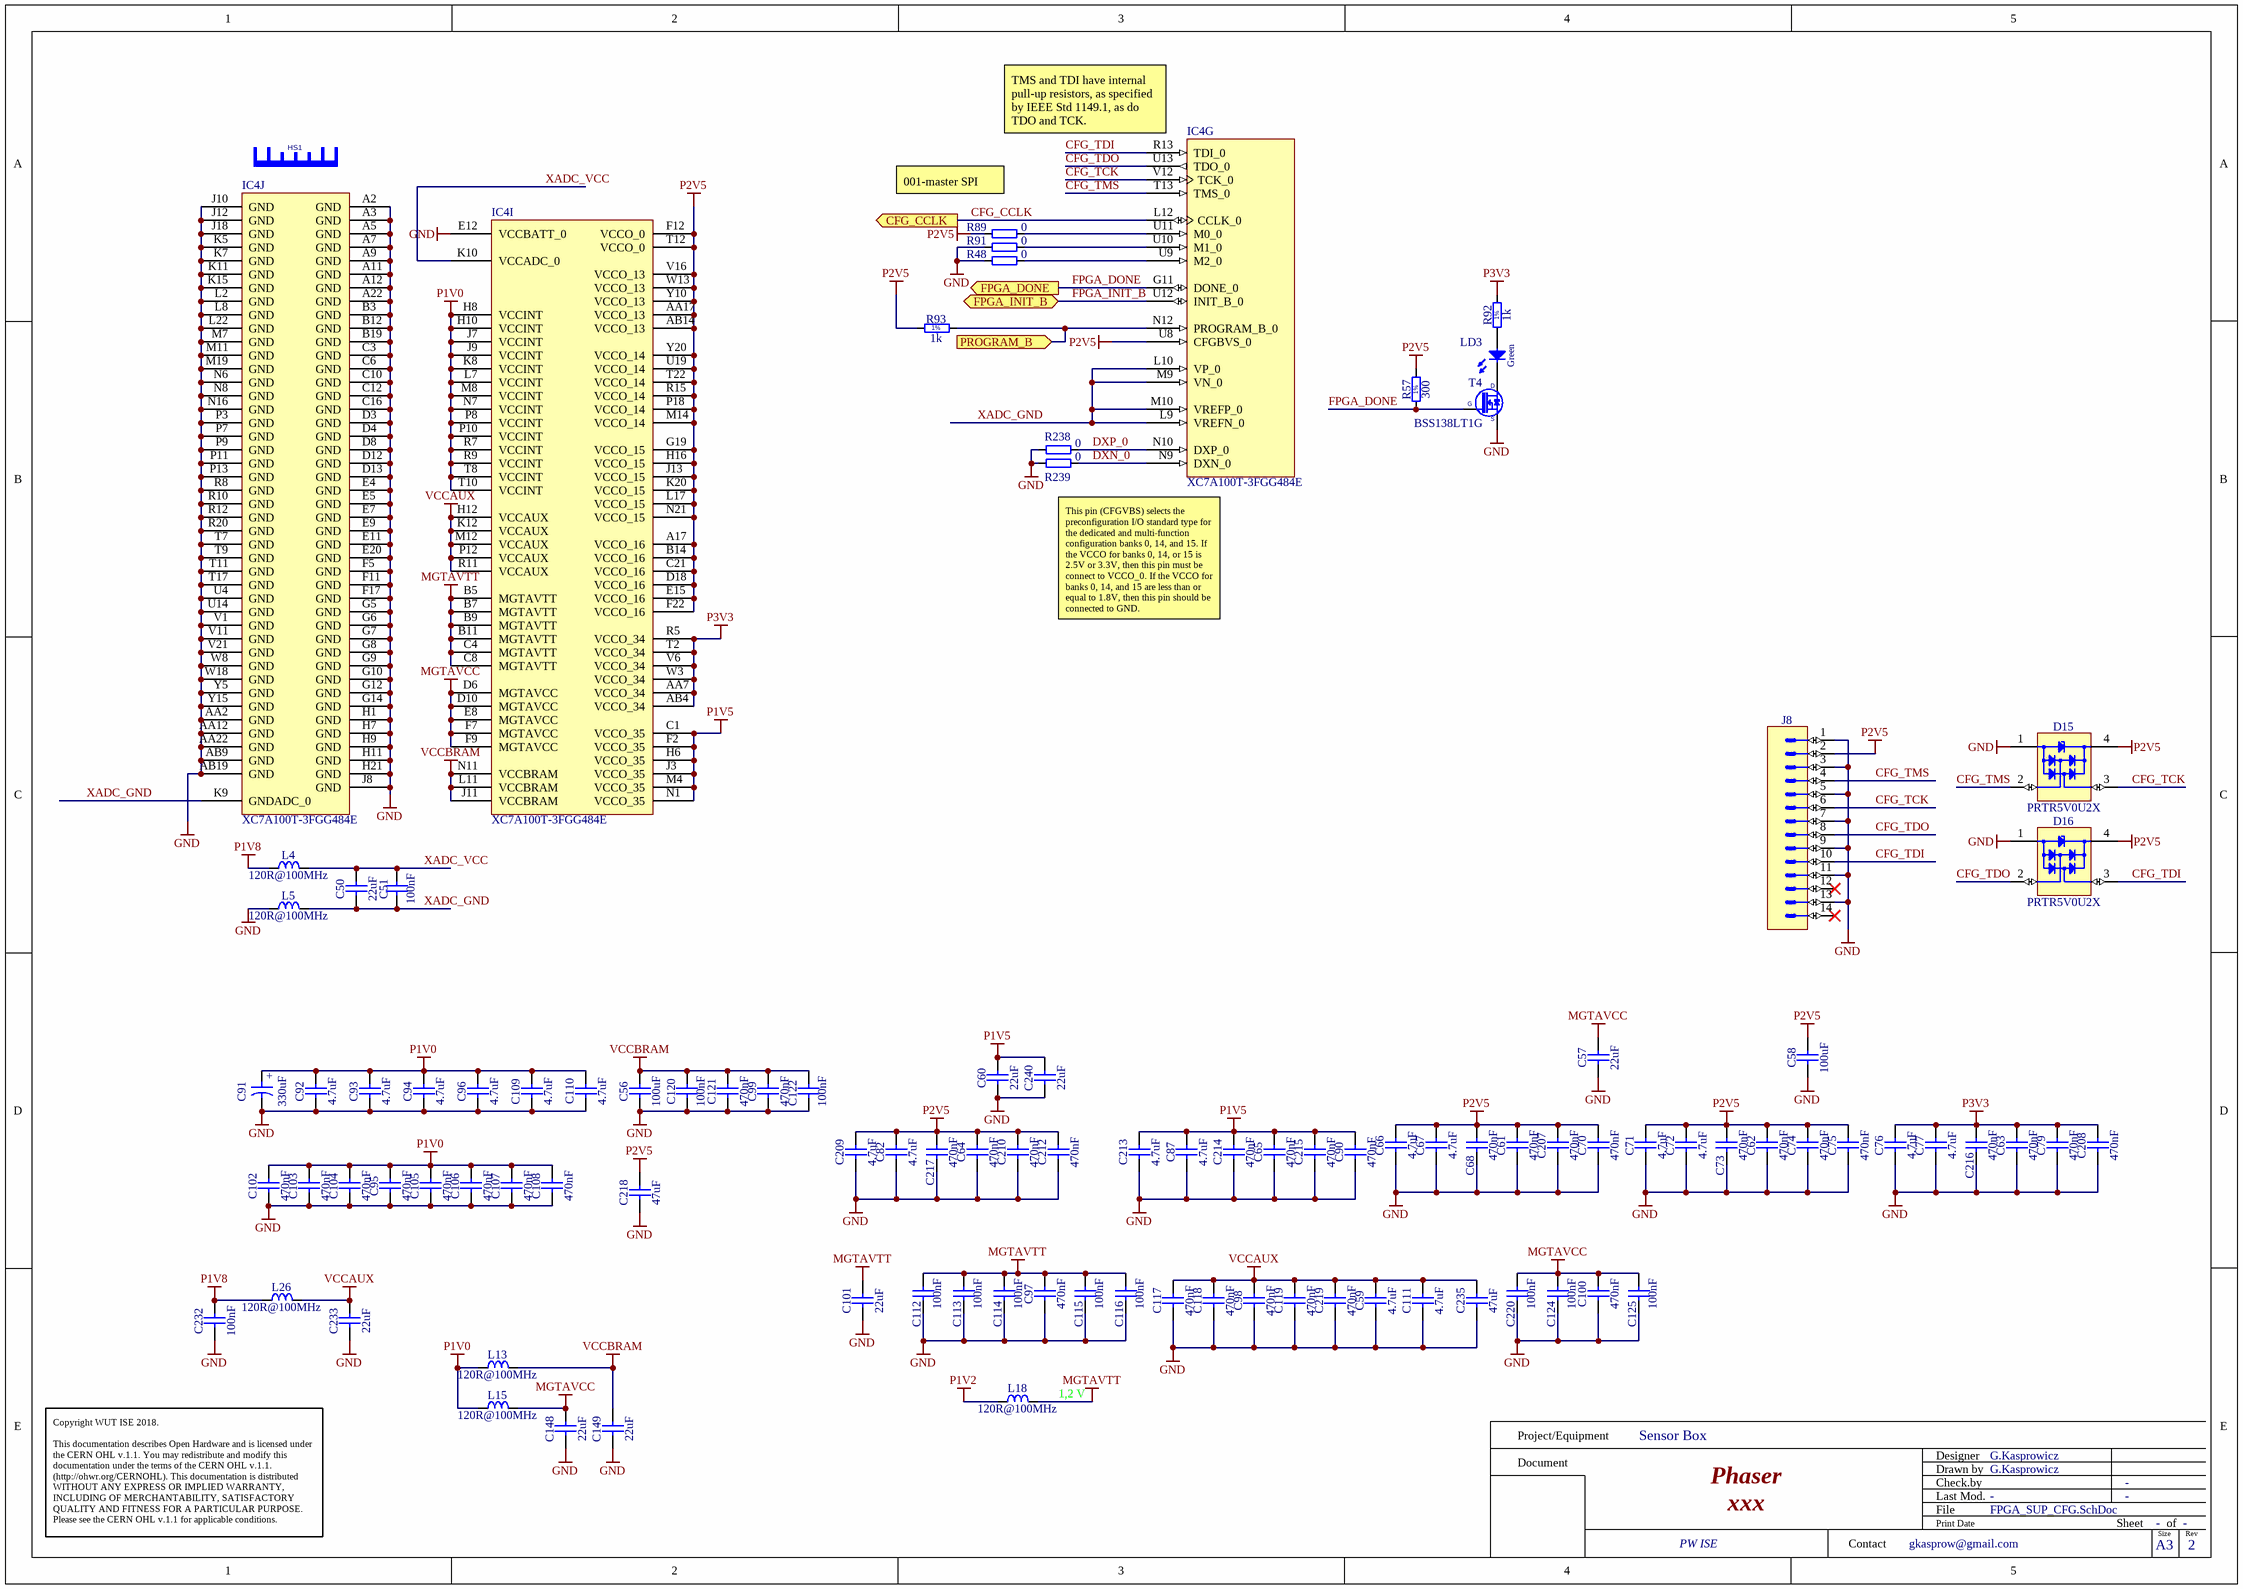
[diagram p7: FPGA_SUP_CFG.SchDoc]

### Parts
C50  22uF  [CAPC1709X100N]
C51  100nF  [CAPC0603X33N]
C56  100uF  [CAPC3225X270N]
C57  22uF  [CAPC1709X100N]
C58  100uF  [CAPC3225X270N]
C59  4.7uF  [CAPC2012X135N]
C60  22uF  [CAPC1709X100N]
C61  470nF  [CAPC0603X33N]
C62  470nF  [CAPC0603X33N]
C63  470nF  [CAPC0603X33N]
C64  470nF  [CAPC0603X33N]
C65  470nF  [CAPC0603X33N]
C66  4.7uF  [CAPC2012X135N]
C67  4.7uF  [CAPC2012X135N]
C68  470nF  [CAPC0603X33N]
C70  470nF  [CAPC0603X33N]
C71  4.7uF  [CAPC2012X135N]
C72  4.7uF  [CAPC2012X135N]
C73  470nF  [CAPC0603X33N]
C74  470nF  [CAPC0603X33N]
C75  470nF  [CAPC0603X33N]
C76  4.7uF  [CAPC2012X135N]
C77  4.7uF  [CAPC2012X135N]
C79  470nF  [CAPC0603X33N]
C82  4.7uF  [CAPC2012X135N]
C87  4.7uF  [CAPC2012X135N]
C90  470nF  [CAPC0603X33N]
C91  330uF  [CAPMP7343X190N]
C92  4.7uF  [CAPC2012X135N]
C93  4.7uF  [CAPC2012X135N]
C94  4.7uF  [CAPC2012X135N]
C95  470nF  [CAPC0603X33N]
C96  4.7uF  [CAPC2012X135N]
C97  470nF  [CAPC0603X33N]
C98  470nF  [CAPC0603X33N]
C99  470nF  [CAPC0603X33N]
C100  470nF  [CAPC0603X33N]
C101  22uF  [CAPC1709X100N]
C102  470nF  [CAPC0603X33N]
C103  470nF  [CAPC0603X33N]
C104  470nF  [CAPC0603X33N]
C105  470nF  [CAPC0603X33N]
C106  470nF  [CAPC0603X33N]
C107  470nF  [CAPC0603X33N]
C108  470nF  [CAPC0603X33N]
C109  4.7uF  [CAPC2012X135N]
C110  4.7uF  [CAPC2012X135N]
C111  4.7uF  [CAPC2012X135N]
C112  100nF  [CAPC0603X33N]
C113  100nF  [CAPC0603X33N]
C114  100nF  [CAPC0603X33N]
C115  100nF  [CAPC0603X33N]
C116  100nF  [CAPC0603X33N]
C117  470nF  [CAPC0603X33N]
C118  470nF  [CAPC0603X33N]
C119  470nF  [CAPC0603X33N]
C120  100nF  [CAPC0603X33N]
C121  470nF  [CAPC0603X33N]
C122  100nF  [CAPC0603X33N]
C124  100nF  [CAPC0603X33N]
C125  100nF  [CAPC0603X33N]
C148  22uF  [CAPC1709X100N]
C149  22uF  [CAPC1709X100N]
C207  470nF  [CAPC0603X33N]
C208  470nF  [CAPC0603X33N]
C209  4.7uF  [CAPC2012X135N]
C210  470nF  [CAPC0603X33N]
C212  470nF  [CAPC0603X33N]
C213  4.7uF  [CAPC2012X135N]
C214  470nF  [CAPC0603X33N]
C215  470nF  [CAPC0603X33N]
C216  470nF  [CAPC0603X33N]
C217  470nF  [CAPC0603X33N]
C218  47uF  [CAPC3225X270N]
C219  470nF  [CAPC0603X33N]
C220  100nF  [CAPC0603X33N]
C232  100nF  [CAPC0603X33N]
C233  22uF  [CAPC1709X100N]
C235  47uF  [CAPC3225X270N]
C240  22uF  [CAPC1709X100N]
D15  PRTR5V0U2X  [SOT190P230X110-4N]
D16  PRTR5V0U2X  [SOT190P230X110-4N]
HS1  RADIAN_FI23  [RADIAN_FI23]  (value not drawn)
IC4  XC7A100T-3FGG484E  [FGG484]  (parts G,I,J of 10)
J8  Milli-Grid™  [MOLEX_87832-1420]  (value not drawn)
L4  120R@100MHz  [INDC1608X65N]
L5  120R@100MHz  [INDC1608X65N]
L13  120R@100MHz  [INDC1608X65N]
L15  120R@100MHz  [INDC1608X65N]
L18  120R@100MHz  [INDC1608X65N]
L26  120R@100MHz  [INDC1608X65N]
LD3  Green  [LED_KINGBRIGHT_KPH-1608CGCK]
R48  0  [RESC1005X40N]
R57  300  [RESC1005X40N]
R89  0  [RESC1005X40N]
R91  0  [RESC1005X40N]
R92  1k  [RESC1005X40N]
R93  1k  [RESC1005X40N]
R238  0  [RESC1005X40N]
R239  0  [RESC1005X40N]
T4  BSS138LT1G  [SOT95P240X110-3N]

### Ports
CFG_CCLK (out), FPGA_DONE (out), FPGA_INIT_B (bidir), PROGRAM_B (in)

### Nets
GND: C56.1 C57.1 C58.1 C59.1 C60.1 C61.1 C62.1 C63.1 C64.1 C65.1 C66.1 C67.1 C68.1 C70.1 C71.1 C72.1 C73.1 C74.1 C75.1 C76.1 C77.1 C79.1 C82.1 C87.1 C90.1 C91.2 C92.1 C93.1 C94.1 C95.1 C96.1 C97.1 C98.1 C99.1 C100.1 C101.1 C102.1 C103.1 C104.1 C105.1 C106.1 C107.1 C108.1 C109.1 C110.1 C111.1 C112.1 C113.1 C114.1 C115.1 C116.1 C117.1 C118.1 C119.1 C120.1 C121.1 C122.1 C124.1 C125.1 C148.1 C149.1 C207.1 C208.1 C209.1 C210.1 C212.1 C213.1 C214.1 C215.1 C216.1 C217.1 C218.1 C219.1 C220.1 C232.1 C233.1 C235.1 C240.1 D15.1(GND) D16.1(GND) IC4.A2(GND) IC4.A3(GND) IC4.A5(GND) IC4.A7(GND) IC4.A9(GND) IC4.A11(GND) IC4.A12(GND) IC4.A22(GND) IC4.AA2(GND) IC4.AA12(GND) IC4.AA22(GND) IC4.AB9(GND) IC4.AB19(GND) IC4.B3(GND) IC4.B12(GND) IC4.B19(GND) IC4.C3(GND) IC4.C6(GND) IC4.C10(GND) IC4.C12(GND) IC4.C16(GND) IC4.D3(GND) IC4.D4(GND) IC4.D8(GND) IC4.D12(GND) IC4.D13(GND) IC4.E4(GND) IC4.E5(GND) IC4.E7(GND) IC4.E9(GND) IC4.E11(GND) IC4.E12(VCCBATT_0) IC4.E20(GND) IC4.F5(GND) IC4.F11(GND) IC4.F17(GND) IC4.G5(GND) IC4.G6(GND) IC4.G7(GND) IC4.G8(GND) IC4.G9(GND) IC4.G10(GND) IC4.G12(GND) IC4.G14(GND) IC4.H1(GND) IC4.H7(GND) IC4.H9(GND) IC4.H11(GND) IC4.H21(GND) IC4.J8(GND) IC4.J10(GND) IC4.J12(GND) IC4.J18(GND) IC4.K5(GND) IC4.K7(GND) IC4.K11(GND) IC4.K15(GND) IC4.L2(GND) IC4.L8(GND) IC4.L22(GND) IC4.M7(GND) IC4.M11(GND) IC4.M19(GND) IC4.N6(GND) IC4.N8(GND) IC4.N16(GND) IC4.P3(GND) IC4.P7(GND) IC4.P9(GND) IC4.P11(GND) IC4.P13(GND) IC4.R8(GND) IC4.R10(GND) IC4.R12(GND) IC4.R20(GND) IC4.T7(GND) IC4.T9(GND) IC4.T11(GND) IC4.T17(GND) IC4.U4(GND) IC4.U14(GND) IC4.V1(GND) IC4.V11(GND) IC4.V21(GND) IC4.W8(GND) IC4.W18(GND) IC4.Y5(GND) IC4.Y15(GND) J8.1 J8.3 J8.5 J8.7 J8.9 J8.11 J8.13 L5.1 R48.1 R91.1 R238.1 R239.1 T4.2(S)
MGTAVCC: C57.2 C100.2 C124.2 C125.2 C148.2 C220.2 IC4.D6(MGTAVCC) IC4.D10(MGTAVCC) IC4.E8(MGTAVCC) IC4.F7(MGTAVCC) IC4.F9(MGTAVCC) L15.2
MGTAVTT: C97.2 C101.2 C112.2 C113.2 C114.2 C115.2 C116.2 IC4.B5(MGTAVTT) IC4.B7(MGTAVTT) IC4.B9(MGTAVTT) IC4.B11(MGTAVTT) IC4.C4(MGTAVTT) IC4.C8(MGTAVTT) L18.2
P1V0: C91.1 C92.2 C93.2 C94.2 C95.2 C96.2 C102.2 C103.2 C104.2 C105.2 C106.2 C107.2 C108.2 C109.2 C110.2 IC4.H8(VCCINT) IC4.H10(VCCINT) IC4.J7(VCCINT) IC4.J9(VCCINT) IC4.K8(VCCINT) IC4.L7(VCCINT) IC4.M8(VCCINT) IC4.N7(VCCINT) IC4.P8(VCCINT) IC4.P10(VCCINT) IC4.R7(VCCINT) IC4.R9(VCCINT) IC4.T8(VCCINT) IC4.T10(VCCINT) L13.1 L15.1
P1V2: L18.1
P1V5: C60.2 C65.2 C87.2 C90.2 C213.2 C214.2 C215.2 C240.2 IC4.C1(VCCO_35) IC4.F2(VCCO_35) IC4.H6(VCCO_35) IC4.J3(VCCO_35) IC4.M4(VCCO_35) IC4.N1(VCCO_35)
P1V8: C232.2 L4.1 L26.1
P2V5: C58.2 C61.2 C62.2 C64.2 C66.2 C67.2 C68.2 C70.2 C71.2 C72.2 C73.2 C74.2 C75.2 C82.2 C207.2 C209.2 C210.2 C212.2 C217.2 C218.2 D15.4(VCC) D16.4(VCC) IC4.A17(VCCO_16) IC4.AA17(VCCO_13) IC4.AB14(VCCO_13) IC4.B14(VCCO_16) IC4.C21(VCCO_16) IC4.D18(VCCO_16) IC4.E15(VCCO_16) IC4.F12(VCCO_0) IC4.F22(VCCO_16) IC4.G19(VCCO_15) IC4.H16(VCCO_15) IC4.J13(VCCO_15) IC4.K20(VCCO_15) IC4.L17(VCCO_15) IC4.M14(VCCO_14) IC4.N21(VCCO_15) IC4.P18(VCCO_14) IC4.R15(VCCO_14) IC4.T12(VCCO_0) IC4.T22(VCCO_14) IC4.U8(CFGBVS_0) IC4.U19(VCCO_14) IC4.V16(VCCO_13) IC4.W13(VCCO_13) IC4.Y10(VCCO_13) IC4.Y20(VCCO_14) J8.2 R57.2 R89.1 R93.1
P3V3: C63.2 C76.2 C77.2 C79.2 C208.2 C216.2 IC4.AA7(VCCO_34) IC4.AB4(VCCO_34) IC4.R5(VCCO_34) IC4.T2(VCCO_34) IC4.V6(VCCO_34) IC4.W3(VCCO_34) R92.2
VCCAUX: C59.2 C98.2 C111.2 C117.2 C118.2 C119.2 C219.2 C233.2 C235.2 IC4.H12(VCCAUX) IC4.K12(VCCAUX) IC4.M12(VCCAUX) IC4.P12(VCCAUX) IC4.R11(VCCAUX) L26.2
VCCBRAM: C56.2 C99.2 C120.2 C121.2 C122.2 C149.2 IC4.J11(VCCBRAM) IC4.L11(VCCBRAM) IC4.N11(VCCBRAM) L13.2
CFG_CCLK: IC4.L12(CCLK_0) ; port CFG_CCLK
CFG_TCK: D15.3(I/O2) IC4.V12(TCK_0) J8.6
CFG_TDI: D16.3(I/O2) IC4.R13(TDI_0) J8.10
CFG_TDO: D16.2(I/O1) IC4.U13(TDO_0) J8.8
CFG_TMS: D15.2(I/O1) IC4.T13(TMS_0) J8.4
DXN_0: IC4.N9(DXN_0) R239.2
DXP_0: IC4.N10(DXP_0) R238.2
FPGA_DONE: IC4.G11(DONE_0) R57.1 T4.1(G) ; port FPGA_DONE
FPGA_INIT_B: IC4.U12(INIT_B_0) ; port FPGA_INIT_B
XADC_GND: C50.1 C51.1 IC4.K9(GNDADC_0) IC4.L9(VREFN_0) IC4.L10(VP_0) IC4.M9(VN_0) IC4.M10(VREFP_0) L5.2
XADC_VCC: C50.2 C51.2 IC4.K10(VCCADC_0) L4.2
NetIC4_N12: IC4.N12(PROGRAM_B_0) R93.2 ; port PROGRAM_B
NetIC4_U9: IC4.U9(M2_0) R48.2
NetIC4_U10: IC4.U10(M1_0) R91.2
NetIC4_U11: IC4.U11(M0_0) R89.2
NetLD3_1: LD3.1(C) T4.3(D)
NetLD3_2: LD3.2(A) R92.1

Not connected (* = marked no-connect by the designer): J8 12* 14*

### Notes on the sheet
- (near IC4) TMS and TDI have internal pull-up resistors, as specified by IEEE Std 1149.1, as do TDO and TCK.
- 001-master SPI
- This pin (CFGVBS) selects the preconfiguration I/O standard type for the dedicated and multi-function configuration banks 0, 14, and 15. If the VCCO for banks 0, 14, or 15 is 2.5V or 3.3V, then this pin must be connect to VCCO_0. If the VCCO for banks 0, 14, and 15 are less than or equal to 1.8V, then this pin should be connected to GND.
- (near L18) 1,2 V
- Project/Equipment
- Document
- Designer
- Drawn by
- Check.by
- Copyright WUT ISE 2018.
  This documentation describes Open Hardware and is licensed under the CERN OHL v.1.1. You may redistribute and modify this documentation under the terms of the CERN OHL v.1.1. (http://ohwr.org/CERNOHL). This documentation is distributed WITHOUT ANY EXPRESS OR IMPLIED WARRANTY, INCLUDING OF MERCHANTABILITY, SATISFACTORY QUALITY AND FITNESS FOR A PARTICULAR PURPOSE. Please see the CERN OHL v.1.1 for applicable conditions.
- Contact
- File
- Last Mod.
- Print Date
- Sheet
- Size
- A3
- of
- Rev
- (in symbol CTE7343-19_330UF_2.5V_20%_LESR0025_KEMET_T520) +
- (in symbol R0402_1K_1%_0.0625W_100PPM) 1%
- (in symbol R0402_1k_1%_0.0625W_100PPM) 1%
- (in symbol R0402_300R_1%_0.0625W_100PPM) 1%

### Library data of the parts
C50 C57 C60 C101 C148 C149 C233 C240 = CC0603_22UF_6.3V_20%_X5R: Non-polarised capacitor; Part Description: SMD Multilayer Chip Ceramic Capacitor; Manufacturer: GENERIC; Manufacturer1 Part Number: C1608X5R0J226M080AC; Voltage: 6.3V; TC: X5R; Tolerance: ±20%; Part Number: CC0603_22UF_6.3V_20%_X5R; Component Kind: Standard; Component Type: Standard; Pin Count: 2; Value: 22uF; Status: None; Manufacturer Part Number: CC0603_22UF_6.3V_20%_X5R; Case: 0603; Mounted: Yes; Socket: No; SMD: Yes; Sense: No; Manufacturer1 Example: TDK; Manufacturer1 ComponentHeight: 1mm; HelpURL: \\cern.ch\dfs\Applications\Altium\Datasheets\CC0603_X5R_TDK_C.pdf; Author: CERN DEM JLC; CreateDate: 16.12.2013; LatestRevisionDate: 13.09.2016
  C50 C57 C60 C101 C240: ClassName: Artix
C51 C112-C116 C120 C122 C124 C125 C220 C232 = CC0201_100NF_6.3V_10%_X5R: Non-polarised capacitor; Part Description: SMD Multilayer Chip Ceramic Capacitor; Manufacturer: GENERIC; Manufacturer1 Part Number: 02016D104KAT2A; Voltage: 6.3V; TC: X5R; Tolerance: ±10%; Part Number: CC0201_100NF_6.3V_10%_X5R; Component Kind: Standard; Component Type: Standard; Pin Count: 2; Value: 100nF; Status: Not Recommended; Manufacturer Part Number: CC0201_100NF_6.3V_10%_X5R; Case: 0201; Mounted: Yes; Socket: No; SMD: Yes; Sense: No; Manufacturer1 Example: AVX; Manufacturer1 ComponentHeight: 0.33mm; HelpURL: \\cern.ch\dfs\Applications\Altium\Datasheets\CC0201_X5R_AVX.pdf; Author: CERN DEM JLC
  C51 C112-C116 C120 C122 C124 C125 C220: CreateDate: 2007-12-03; LatestRevisionDate: 2007-12-03; ClassName: Artix
  C232: CreateDate: 03.12.2007; LatestRevisionDate: 03.12.2007
C56 C58 = CC1210_100UF_6.3V_20%_X5R: Non-polarised capacitor; Part Description: SMD Multilayer Chip Ceramic Capacitor; Manufacturer: GENERIC; Manufacturer1 Part Number: GRM32ER60J107ME20L; Voltage: 6.3V; TC: X5R; Tolerance: ±20%; Part Number: CC1210_100UF_6.3V_20%_X5R; Component Kind: Standard; Component Type: Standard; Pin Count: 2; Value: 100uF; Status: Preferred; Manufacturer Part Number: CC1210_100UF_6.3V_20%_X5R; Case: 1210; Mounted: Yes; Socket: No; SMD: Yes; Sense: No; Manufacturer1 Example: MURATA; Manufacturer1 ComponentHeight: 2.7mm; HelpURL: \\cern.ch\dfs\Applications\Altium\Datasheets\CC1210_X5R_MURATA.pdf; Author: CERN DEM JLC; CreateDate: 19.04.2010; LatestRevisionDate: 19.04.2010
C59 C66 C67 C71 C72 C76 C77 C82 C87 C92-C94 C96 C109-C111 C209 C213 = CC0805_4.7UF_10V_10%_X5R: Non-polarised capacitor; Manufacturer: GENERIC; Part Description: SMD Multilayer Chip Ceramic Capacitor; Manufacturer1 Part Number: 222224013672; Voltage: 10V; TC: X5R; Tolerance: ±10%; Part Number: CC0805_4.7UF_10V_10%_X5R; Component Kind: Standard; Component Type: Standard; Pin Count: 2; Value: 4.7uF; Status: Preferred; Manufacturer Part Number: CC0805_4.7UF_10V_10%_X5R; Case: 0805; Mounted: Yes; Socket: No; SMD: Yes; Sense: No; Manufacturer1 Example: PHYCOMP; Manufacturer1 ComponentHeight: 1.45mm; HelpURL: \\cern.ch\dfs\Applications\Altium\Datasheets\CC0805_X5R_PHYCOMP_HC.pdf; Author: CERN DEM JLC; CreateDate: 03.12.2007; LatestRevisionDate: 03.12.2007
C61-C65 C68 C70 C73-C75 C79 C90 C95 C97-C100 C102-C108 C117-C119 C121 C207 C208 C210 C212 C214-C217 C219 = CC0201_470NF_4V_20%_X5R: Non-polarised capacitor; Part Description: SMD Multilayer Chip Ceramic Capacitor; Manufacturer: GENERIC; Manufacturer1 Part Number: AMK063BJ474MP-F; Voltage: 4V; TC: X5R; Tolerance: ±20%; Part Number: CC0201_470NF_4V_20%_X5R; Component Kind: Standard; Component Type: Standard; Pin Count: 2; Value: 470nF; Status: Not Recommended; Manufacturer Part Number: CC0201_470NF_4V_20%_X5R; Case: 0201; Mounted: Yes; Socket: No; SMD: Yes; Sense: No; Manufacturer1 Example: TAIYO YUDEN; Manufacturer1 ComponentHeight: 0.33mm; HelpURL: \\cern.ch\dfs\Applications\Altium\Datasheets\CC0201_X5R_TAIYO-YUDEN_STANDARD-CLASS2.pdf; Author: CERN DEM JLC; CreateDate: 27.05.2010; LatestRevisionDate: 27.05.2010
  C61-C65 C95 C97-C100: ClassName: Artix
C91 = CTE7343-19_330UF_2.5V_20%_LESR0025_KEMET_T520: Polarised capacitor; Part Description: Low ESR 0R025 Tantalum Chip Capacitor; Manufacturer: KEMET; Manufacturer Part Number: T520V337M2R5ATE025; Voltage: 2.5V; Tolerance: ±20%; Part Number: CTE7343-19_330UF_2.5V_20%_LESR0025_KEMET_T520; Component Kind: Standard; Component Type: Standard; Pin Count: 2; Value: 330uF; Status: None; Case: V; Mounted: Yes; Socket: No; SMD: Yes; Sense: No; ComponentHeight: 1.9mm; HelpURL: \\cern.ch\dfs\Applications\Altium\Datasheets\CTE-LESR_KEMET_T520.pdf; Author: CERN DEM MR; CreateDate: 23.03.2016; LatestRevisionDate: 23.03.2016
C218 C235 = CC1210_47UF_10V_10%_X7R: Non-polarised capacitor; Part Description: SMD Multilayer Chip Ceramic Capacitor; Manufacturer: GENERIC; Manufacturer1 Part Number: GRM32ER71A476KE15; Voltage: 10V; TC: X7R; Tolerance: ±10%; Part Number: CC1210_47UF_10V_10%_X7R; Component Kind: Standard; Component Type: Standard; Pin Count: 2; Value: 47uF; Status: None; Manufacturer Part Number: CC1210_47UF_10V_10%_X7R; Case: 1210; Mounted: Yes; Socket: No; SMD: Yes; Sense: No; Manufacturer1 Example: MURATA; Manufacturer1 ComponentHeight: 2.7mm; HelpURL: \\cern.ch\dfs\Applications\Altium\Datasheets\CC1210_X7R_MURATA.pdf; Author: CERN DEM BC; CreateDate: 18.11.2015; LatestRevisionDate: 18.11.2015
D15 D16 = PRTR5V0U2X: Ultra Low Capacitance Double Rail-to-Rail ESD Protection Diode; Part Description: Ultra Low Capacitance (1pF) Double Rail-to-Rail ESD Protection Diode (8kV); Manufacturer: NXP SEMICONDUCTORS; Voltage: 5.5V; PressFit: No; Bonding: No; Part Number: PRTR5V0U2X; Component Kind: Standard; Component Type: Standard; Device: PRTR5V0U2X; PackageDescription: SOT143B, SOT, 1.90mm Pitch; 4 Pin, 1.30mm W X 2.90mm L X 1.10mm H body, IPC Medium Density; Manufacturer Part Number: PRTR5V0U2X; Pin Count: 4; Case: SOT143B; Mounted: Yes; Socket: No; SMD: Yes; Sense: No; ComponentHeight: 1.1mm; HelpURL: \\cern.ch\dfs\Applications\Altium\Datasheets\PRTR5V0U2X.pdf; Author: CERN DEM JLC; CreateDate: 22.03.2011; LatestRevisionDate: 22.03.2011
HS1 = RADIAN_FI23: Heat Sink Without Pad; Manufacturer: Radian Thermal Products, Inc.; Manufacturer Part Number: FI23+BU+T725; Part Description: 23 x 23 x 16 mm, clip on heatsink with fan for IC design BGA and others; ComponentHeight: 16 mm; HelpURL: https://www.radianheatsinks.com/product/fi23/
IC4 = CMP-0364-00028-3: Artix-7 FPGA, 285 User I/Os, 4 GTP, 484-Ball BGA, Speed Grade 3, Extended Grade, Pb-Free; Manufacturer: Xilinx; Max User I/O: 300; Clock Mgmt Tiles (CMTs): 6; Logic Cells: 101440; Block RAM Blocks (36Kb): 135; Block RAM Blocks (18Kb): 270; Speed Grade: -3; CLBs (Slices): 15850; Block RAM Blocks (Max Kb): 4860; DSP48E1 Slices: 240; RoHS: Pb-Free; ComponentLink3URL: http://www.xilinx.com/support/documentation/data_sheets/ds181_Artix_7_Data_Sheet.pdf; NexusDeviceID: XC7A100T-3FGG484E; DatasheetVersion: v1.12; Mounting Technology: Surface Mount; PackageDescription: Wire-Bond Fine-Pitch BGA, Body 23 x 23 mm, 1.0 mm Pitch; PackageReference: FGG484; ComponentLink2Description: Package Specification; Code_JEDEC: MS-034-AAJ-1; ComponentLink2URL: http://www.xilinx.com/support/documentation/user_guides/ug475_7Series_Pkg_Pinout.pdf; ComponentLink3Description: DC and Switching Characteristics; Generic Part Number: XC7A100T; ComponentLink4Description: Package File; ComponentLink4URL: http://www.xilinx.com/support/packagefiles/a7packages/xc7a100tfgg484pkg.txt; ComponentLink1URL: http://www.xilinx.com/support/documentation/data_sheets/ds180_7Series_Overview.pdf; PartNumber: XC7A100T-3FGG484E; ComponentLink5URL: http://www.xilinx.com/support/documentation/user_guides/ug475_7Series_Pkg_Pinout.pdf; PackageVersion: Rev 1.8; ComponentLink5Description: Packaging and Pinout; ComponentLink1Description: Datasheet; CLBs (Max Distributed RAM Kb): 1188
J8 = MOLEX_87832-1420: Connector 14 Male; Part Description: 2.00mm (.079") Pitch Milli-Grid™ Header, Surface Mount, Vertical, Shrouded, 14 Circuits,with Locking Windows and Centre Polarization Slot, PCB Locator; Manufacturer: MOLEX; PressFit: No; Part Number: MOLEX_87832-1420; Component Kind: Standard; Component Type: Standard; Pin Count: 14; Family: Milli-Grid™; Mounted: Yes; Socket: No; SMD: Yes; Sense: No; Status: None; Manufacturer Part Number: 87832-1420; ComponentHeight: 7.6mm; HelpURL: \\cern.ch\dfs\Applications\Altium\Datasheets\MOLEX_87832-1420.pdf; Author: CERN DEM JLC; CreateDate: 09.09.2008; LatestRevisionDate: 09.09.2008
L4 L5 L13 L15 L18 L26 = IND0603_MURATA_BLM18SG121TN1D: Inductor; Part Description: SMD EMIFIL Suppression Chip Ferrite Bead; Manufacturer: MURATA; Power: 3A; Resistance: 0.025R; Tolerance: ±25%; Part Number: IND0603_MURATA_BLM18SG121TN1D; Component Kind: Standard; Component Type: Standard; Pin Count: 2; Value: 120R@100MHz; Status: None; Manufacturer Part Number: BLM18SG121TN1D; Case: 0603; Mounted: Yes; Socket: No; SMD: Yes; Sense: No; ComponentHeight: 0.65mm; HelpURL: \\cern.ch\dfs\Applications\Altium\Datasheets\IND0603_MURATA_BLM18S.pdf; Author: CERN DEM JLC; CreateDate: 23.07.2014; LatestRevisionDate: 23.07.2014
  L4 L5: ClassName: Artix
LD3 = LED_KINGBRIGHT_KPH-1608CGCK: LED Green 1C 2A; Part Description: SMD Green LED, Case 1.6mmX0.8mm(0603), 0.65mm Thickness; PressFit: No; Bonding: No; Manufacturer Part Number: KPH-1608CGCK; ComponentHeight: 0.65mm; HelpURL: \\cern.ch\dfs\Applications\Altium\Datasheets\LED_KINGBRIGHT_KPH-1608CGCK.pdf; Part Number: LED_KINGBRIGHT_KPH-1608CGCK; Component Kind: Standard; Component Type: Standard; Color: Green; PackageDescription: SMT Green LED, Case 0603, Body L 1.6 x W 0.8mm H 0.65mm; Manufacturer: KINGBRIGHT; Pin Count: 2; Mounted: Yes; Socket: No; SMD: Yes; Sense: No; Author: CERN DEM JLC; CreateDate: 03.07.2017; LatestRevisionDate: 03.07.2017
R48 R89 R91 R238 R239 = R0402_0R_JUMPER: Resistor; Part Description: 1A (0.05R Max DC Resistance) Zero Ohm Jumper; Manufacturer: GENERIC; Manufacturer1 Part Number: 232270591001L; PressFit: No; Part Number: R0402_0R_JUMPER; Component Kind: Standard; Component Type: Standard; Pin Count: 2; Value: 0; Status: Not Recommended; Manufacturer Part Number: R0402_0R_JUMPER; Case: 0402; Mounted: Yes; Sense: No; Socket: No; SMD: Yes; Manufacturer1 Example: YAGEO PHYCOMP; Manufacturer1 ComponentHeight: 0.4mm; HelpURL: \\cern.ch\dfs\Applications\Altium\Datasheets\R0402_Phycomp_RC0402.pdf; Author: CERN DEM JLC; CreateDate: 03.12.2007; LatestRevisionDate: 17.10.2012; ClassName: Artix
R57 = R0402_300R_1%_0.0625W_100PPM: Resistor - 1%; Part Description: General Purpose Thick Film Chip Resistor; Manufacturer: GENERIC; Manufacturer1 Part Number: 232270673001L; TC: ±100ppm/°C; PressFit: No; Part Number: R0402_300R_1%_0.0625W_100PPM; Component Kind: Standard; Component Type: Standard; Pin Count: 2; Value: 300; Status: Not Recommended; Power: 0.0625W; Tolerance: ±1%; Manufacturer Part Number: R0402_300R_1%_0.0625W_100PPM; Case: 0402; Mounted: Yes; Sense: No; Socket: No; SMD: Yes; Manufacturer1 Example: YAGEO PHYCOMP; Manufacturer1 ComponentHeight: 0.4mm; HelpURL: \\cern.ch\dfs\Applications\Altium\Datasheets\R0402_Phycomp_RC0402.pdf; Author: CERN DEM JLC; CreateDate: 03.12.2007; LatestRevisionDate: 17.10.2012
R92 = R0402_1k_1%_0.0625W_100PPM: Resistor - 1%; Part Description: General Purpose Thick Film Chip Resistor; Manufacturer: GENERIC; Manufacturer1 Part Number: 232270671002L; TC: ±100ppm/°C; PressFit: No; Part Number: R0402_1K_1%_0.0625W_100PPM; Component Kind: Standard; Component Type: Standard; Pin Count: 2; Value: 1k; Status: Not Recommended; Power: 0.0625W; Tolerance: ±1%; Manufacturer Part Number: R0402_1K_1%_0.0625W_100PPM; Case: 0402; Mounted: Yes; Sense: No; Socket: No; SMD: Yes; Manufacturer1 Example: YAGEO PHYCOMP; Manufacturer1 ComponentHeight: 0.4mm; HelpURL: \\cern.ch\dfs\Applications\Altium\Datasheets\R0402_Phycomp_RC0402.pdf; Author: CERN DEM JLC; CreateDate: 03.12.2007; LatestRevisionDate: 17.10.2012; ClassName: Artix
R93 = R0402_1K_1%_0.0625W_100PPM: Resistor - 1%; Part Description: General Purpose Thick Film Chip Resistor; Manufacturer: GENERIC; Manufacturer1 Part Number: 232270671002L; TC: ±100ppm/°C; PressFit: No; Part Number: R0402_1K_1%_0.0625W_100PPM; Component Kind: Standard; Component Type: Standard; Pin Count: 2; Value: 1k; Status: Not Recommended; Power: 0.0625W; Tolerance: ±1%; Manufacturer Part Number: R0402_1K_1%_0.0625W_100PPM; Case: 0402; Mounted: Yes; Sense: No; Socket: No; SMD: Yes; Manufacturer1 Example: YAGEO PHYCOMP; Manufacturer1 ComponentHeight: 0.4mm; HelpURL: \\cern.ch\dfs\Applications\Altium\Datasheets\R0402_Phycomp_RC0402.pdf; Author: CERN DEM JLC; CreateDate: 03.12.2007; LatestRevisionDate: 17.10.2012; ClassName: Artix
T4 = BSS138LT1G: N-CHANNEL MOSFET WITH DIODE; Part Description: 50V 200mA N-Channel Enhancement Mode Field-Effect Transistor; Manufacturer: ON SEMICONDUCTOR; PressFit: No; Bonding: No; Part Number: BSS138LT1G; Component Kind: Standard; Component Type: Standard; Device: BSS138LT1G; PackageDescription: SOT23 3-Leads, Pitch 0.95mm - Body 1.4x3mm, IPC Medium Density; Manufacturer Part Number: BSS138LT1G; Pin Count: 3; Case: SOT23-3; Mounted: Yes; Socket: No; SMD: Yes; Sense: No; ComponentHeight: 1.11mm; HelpURL: \\cern.ch\dfs\Applications\Altium\Datasheets\BSS138LT1G.pdf; Author: CERN DEM JLC; CreateDate: 23.03.2009; LatestRevisionDate: 23.03.2009